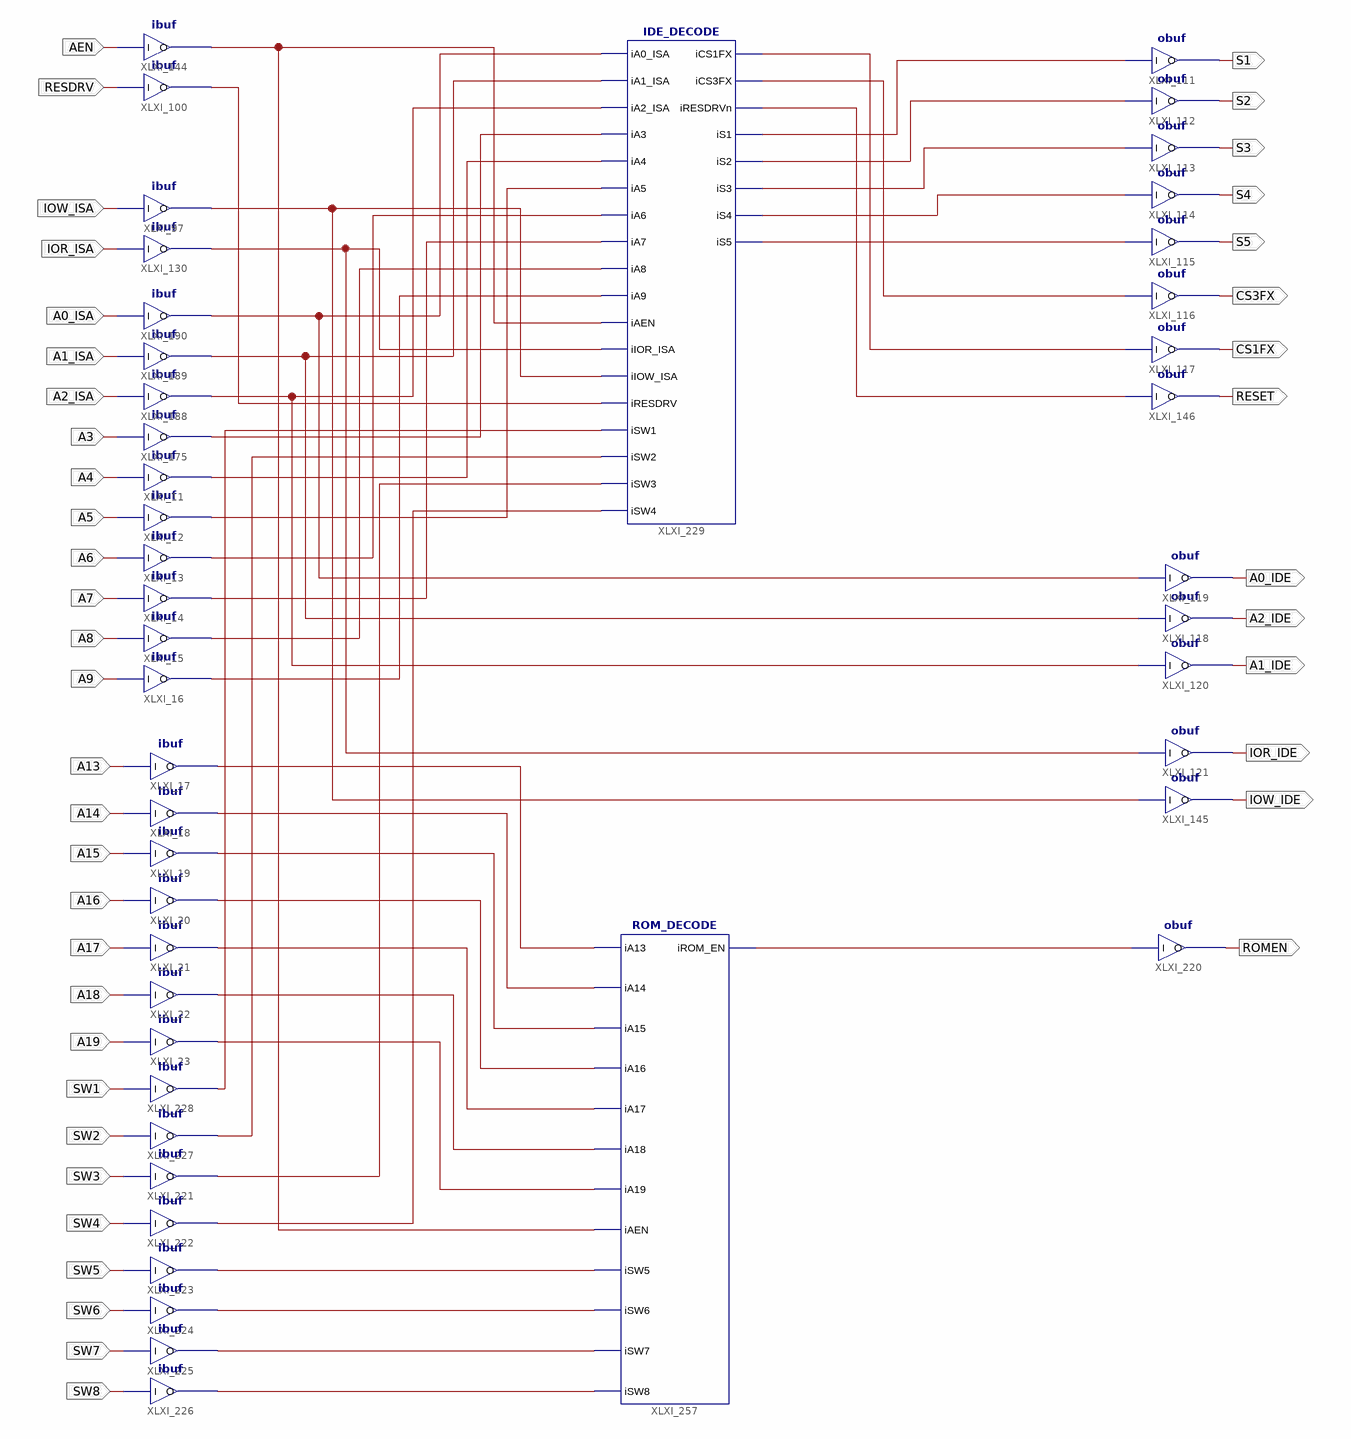
[diagram p0: schematic sheet 1]
// Xilinx ISE schematic Top.sch (xc9500) as structural Verilog: 45 symbols, 43 ports
module Top (
  input  RESDRV,
  input  IOW_ISA,
  input  IOR_ISA,
  input  AEN,
  input  A4,
  input  A5,
  input  A6,
  input  A7,
  input  A8,
  input  A9,
  input  A18,
  input  A17,
  input  A16,
  input  A15,
  input  A14,
  input  A13,
  input  A19,
  input  A3,
  input  A0_ISA,
  input  A1_ISA,
  input  A2_ISA,
  input  SW1,
  input  SW2,
  input  SW3,
  input  SW4,
  input  SW5,
  input  SW6,
  input  SW7,
  input  SW8,
  output S1,
  output S2,
  output S3,
  output S4,
  output S5,
  output CS3FX,
  output CS1FX,
  output RESET,
  output ROMEN,
  output A2_IDE,
  output IOR_IDE,
  output IOW_IDE,
  output A0_IDE,
  output A1_IDE
);

  wire XLXN_275, XLXN_277, XLXN_279, XLXN_281, XLXN_285, XLXN_302, XLXN_303, XLXN_304, XLXN_305, XLXN_306,
       XLXN_307, XLXN_308, XLXN_309, XLXN_310, XLXN_311, XLXN_312, XLXN_315, XLXN_316, XLXN_317, XLXN_318,
       XLXN_320, XLXN_321, XLXN_322, XLXN_323, XLXN_325, XLXN_326, XLXN_327, XLXN_328, XLXN_329, XLXN_330,
       XLXN_331, XLXN_332, XLXN_333, XLXN_346, XLXN_347, XLXN_348, XLXN_349, XLXN_350;

  ibuf XLXI_130 (.I(IOR_ISA), .O(XLXN_349));
  ibuf XLXI_100 (.I(RESDRV), .O(XLXN_285));
  ibuf XLXI_97 (.I(IOW_ISA), .O(XLXN_350));
  ibuf XLXI_144 (.I(AEN), .O(XLXN_318));
  ibuf XLXI_12 (.I(A5), .O(XLXN_277));
  ibuf XLXI_13 (.I(A6), .O(XLXN_316));
  ibuf XLXI_14 (.I(A7), .O(XLXN_279));
  ibuf XLXI_15 (.I(A8), .O(XLXN_317));
  ibuf XLXI_11 (.I(A4), .O(XLXN_315));
  ibuf XLXI_16 (.I(A9), .O(XLXN_281));
  ibuf XLXI_23 (.I(A19), .O(XLXN_306));
  ibuf XLXI_22 (.I(A18), .O(XLXN_307));
  ibuf XLXI_21 (.I(A17), .O(XLXN_308));
  ibuf XLXI_20 (.I(A16), .O(XLXN_309));
  ibuf XLXI_19 (.I(A15), .O(XLXN_310));
  ibuf XLXI_18 (.I(A14), .O(XLXN_311));
  ibuf XLXI_17 (.I(A13), .O(XLXN_312));
  ibuf XLXI_175 (.I(A3), .O(XLXN_275));
  ibuf XLXI_188 (.I(A2_ISA), .O(XLXN_348));
  ibuf XLXI_189 (.I(A1_ISA), .O(XLXN_347));
  ibuf XLXI_190 (.I(A0_ISA), .O(XLXN_346));
  obuf XLXI_111 (.I(XLXN_326), .O(S1));
  obuf XLXI_112 (.I(XLXN_327), .O(S2));
  obuf XLXI_113 (.I(XLXN_328), .O(S3));
  obuf XLXI_114 (.I(XLXN_329), .O(S4));
  obuf XLXI_115 (.I(XLXN_330), .O(S5));
  obuf XLXI_116 (.I(XLXN_331), .O(CS3FX));
  obuf XLXI_117 (.I(XLXN_332), .O(CS1FX));
  obuf XLXI_146 (.I(XLXN_333), .O(RESET));
  IDE_DECODE XLXI_229 (
    .iA0_ISA(XLXN_346), .iA1_ISA(XLXN_347), .iA2_ISA(XLXN_348), .iA3(XLXN_275), .iA4(XLXN_315),
    .iA5(XLXN_277), .iA6(XLXN_316), .iA7(XLXN_279), .iA8(XLXN_317), .iA9(XLXN_281), .iAEN(XLXN_318),
    .iCS1FX(XLXN_332), .iCS3FX(XLXN_331), .iIOR_ISA(XLXN_349), .iIOW_ISA(XLXN_350), .iRESDRV(XLXN_285),
    .iRESDRVn(XLXN_333), .iS1(XLXN_326), .iS2(XLXN_327), .iS3(XLXN_328), .iS4(XLXN_329), .iS5(XLXN_330),
    .iSW1(XLXN_323), .iSW2(XLXN_322), .iSW3(XLXN_321), .iSW4(XLXN_320));
  ibuf XLXI_228 (.I(SW1), .O(XLXN_323));
  ibuf XLXI_227 (.I(SW2), .O(XLXN_322));
  ibuf XLXI_221 (.I(SW3), .O(XLXN_321));
  ibuf XLXI_222 (.I(SW4), .O(XLXN_320));
  ibuf XLXI_223 (.I(SW5), .O(XLXN_305));
  ibuf XLXI_224 (.I(SW6), .O(XLXN_304));
  ibuf XLXI_225 (.I(SW7), .O(XLXN_303));
  ibuf XLXI_226 (.I(SW8), .O(XLXN_302));
  ROM_DECODE XLXI_257 (
    .iA13(XLXN_312), .iA14(XLXN_311), .iA15(XLXN_310), .iA16(XLXN_309), .iA17(XLXN_308), .iA18(XLXN_307),
    .iA19(XLXN_306), .iAEN(XLXN_318), .iROM_EN(XLXN_325), .iSW5(XLXN_305), .iSW6(XLXN_304), .iSW7(XLXN_303),
    .iSW8(XLXN_302));
  obuf XLXI_220 (.I(XLXN_325), .O(ROMEN));
  obuf XLXI_118 (.I(XLXN_347), .O(A2_IDE));
  obuf XLXI_121 (.I(XLXN_349), .O(IOR_IDE));
  obuf XLXI_145 (.I(XLXN_350), .O(IOW_IDE));
  obuf XLXI_119 (.I(XLXN_346), .O(A0_IDE));
  obuf XLXI_120 (.I(XLXN_348), .O(A1_IDE));
endmodule
